# EAGLE design pcb v2 (EAGLE 7.5.0)
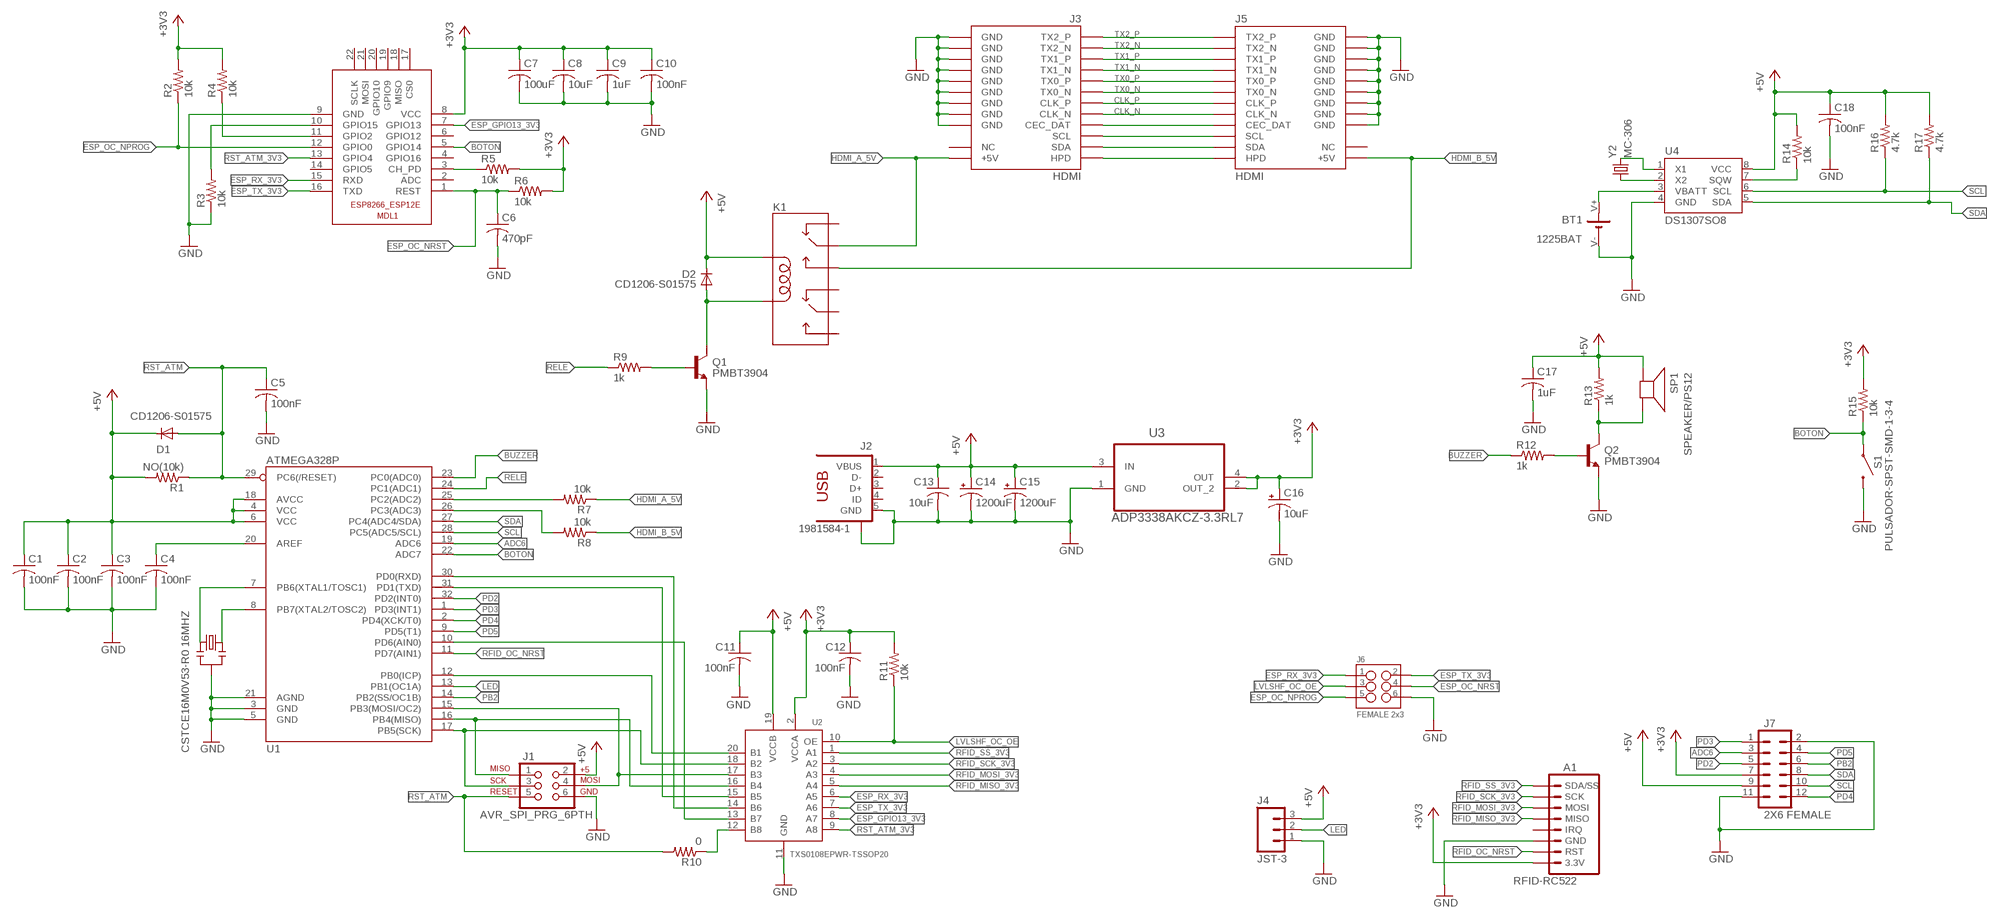
[diagram p0: schematic, sheet 1]

## Parts
A1  RFID-RC522  [RFID-RC522]
BT1  1225BAT  [BHSD-1225-SM]
C1  100nF  C-USC0603  [C0603]
C2  100nF  C-USC0603  [C0603]
C3  100nF  C-USC0603  [C0603]
C4  100nF  C-USC0603  [C0603]
C5  100nF  C-USC0603  [C0603]
C6  470pF  C-USC0603  [C0603]
C7  100uF  C-USC1206  [C1206]
C8  10uF  C-USC0805  [C0805]
C9  1uF  C-USC0805  [C0805]
C10  100nF  C-USC0603  [C0603]
C11  100nF  C-USC0603  [C0603]
C12  100nF  C-USC0603  [C0603]
C13  10uF  C-USC0805  [C0805]
C14  1200uF  CPOL-USUD-10X10  [UD-10X10_NICHICON]
C15  1200uF  CPOL-USUD-10X10  [UD-10X10_NICHICON]
C16  10uF  CPOL-USUD-5X5,8  [UD-5X5,8_NICHICON]
C17  1uF  C-USC0805  [C0805]
C18  100nF  C-USC0603  [C0603]
D1  CD1206-S01575  DIODE-MINIMELF  [MINIMELF]
D2  CD1206-S01575  DIODE-MINIMELF  [MINIMELF]
J1  AVR_SPI_PRG_6PTH  [2X3]
J2  1981584-1  [1981584-1]
J3  HDMI  [0471511071]
J4  JST-3  [B3B-PH-SM4-TB]
J5  HDMI  [0471511071]
J6  FEMALE 2x3  M03X2FEMALE  [2X3]
J7  2X6 FEMALE  M06X2PTH_FEMALE  [2X6]
K1  RELAY_EE2  [RELAY-EE2]
MDL1  ESP8266-12EESP8266-ESP12E  [ESP8266-ESP12E]
Q1  PMBT3904  [SOT-23-3]
Q2  PMBT3904  [SOT-23-3]
R1  NO(10k)  R-US_R0805  [R0805]
R2  10k  R-US_R0603  [R0603]
R3  10k  R-US_R0603  [R0603]
R4  10k  R-US_R0603  [R0603]
R5  10k  R-US_R0603  [R0603]
R6  10k  R-US_R0603  [R0603]
R7  10k  R-US_R0603  [R0603]
R8  10k  R-US_R0603  [R0603]
R9  1k  R-US_R0805  [R0805]
R10  0  R-US_R0805  [R0805]
R11  10k  R-US_R0603  [R0603]
R12  1k  R-US_R0805  [R0805]
R13  1k  R-US_R0805  [R0805]
R14  10k  R-US_R0603  [R0603]
R15  10k  R-US_R0603  [R0603]
R16  4.7k  R-US_R0603  [R0603]
R17  4.7k  R-US_R0603  [R0603]
S1  PULSADOR-SPST-SMD-1-3-4  [PTS645SM43SMTR92]
SP1  SPEAKER/PS12  [PS12]
U1  ATMEGA328P  ATMEGA328_SMT  [TQFP32-08]
U2  TXS0108EPWR-TSSOP20  LOGIC-TXS0108EPWR(TSSOP20)  [TSSOP20-0.65-6.5X4.4MM]
U3  ADP3338AKCZ-3.3RL7  [SOT230P700X180-4N]
U4  DS1307SO8  [SO08]
Y1  CSTCE16M0V53-R0 16MHZ  RESONATORMU  [RESONATOR]
Y2  MC-306  [MC-306]

## Nets
+3V3: A1.3.3V C7.1 C8.1 C9.1 C10.1 C12.1 C16.+ J7.7 MDL1.8(VCC) R2.2 R4.2 R5.2 R6.2 R11.2 R15.2 U2.2(VCCA) U3.2(OUT_2) U3.4(OUT)
+5V: C1.1 C2.1 C3.1 C11.1 C13.1 C14.+ C15.+ C17.1 C18.1 D1.C D2.C J1.2 J2.1(VBUS) J4.3 J7.9 K1.1(COIL+) R1.2 R13.2 R14.2 R16.2 R17.2 SP1.P$1(+) U1.4(VCC) U1.6(VCC) U1.18(AVCC) U2.19(VCCB) U3.3(IN) U4.8(VCC)
ADC6: J7.3 U1.19(ADC6)
BOTON: MDL1.5(GPIO14) R15.1 S1.P$1 U1.22(ADC7)
BUZZER: R12.1 U1.23(PC0(ADC0))
CLK_N [hdmi]: J3.P$12(CLK_N) J5.P$12(CLK_N)
CLK_P [hdmi]: J3.P$10(CLK_P) J5.P$10(CLK_P)
ESP_GPIO13_3V3: MDL1.7(GPIO13) U2.8(A7)
ESP_OC_NPROG: J6.5 MDL1.12(GPIO0) R2.1
ESP_OC_NRST: C6.1 J6.4 MDL1.1(REST) R6.1
ESP_RX_3V3: J6.1 MDL1.15(RXD) U2.6(A5)
ESP_TX_3V3: J6.2 MDL1.16(TXD) U2.7(A6)
GND [gnd]: A1.GND BT1.V- C1.2 C2.2 C3.2 C4.2 C5.2 C6.2 C7.2 C8.2 C9.2 C10.2 C11.2 C12.2 C13.2 C14.- C15.- C16.- C17.2 C18.2 J1.6 J2.5(GND) J2.S1 J2.S2 J2.S3 J2.S4 J3.P$2(GND) J3.P$5(GND) J3.P$8(GND) J3.P$11(GND) J3.P$17(GND) J3.P$20(GND) J3.P$21(GND) J3.P$22(GND) J3.P$23(GND) J4.1 J5.P$2(GND) J5.P$5(GND) J5.P$8(GND) J5.P$11(GND) J5.P$17(GND) J5.P$20(GND) J5.P$21(GND) J5.P$22(GND) J5.P$23(GND) J6.6 J7.2 J7.11 MDL1.9(GND) Q1.2(E) Q2.2(E) R3.1 S1.P$3 S1.P$4 U1.3(GND) U1.5(GND) U1.21(AGND) U2.11(GND) U3.1(GND) U4.4(GND) Y1.2
HDMI_A_5V: J3.P$18(+5V) K1.4(MAIN1) R7.1
HDMI_B_5V: J5.P$18(+5V) K1.5(OFF1) R8.1
LED: J4.2 U1.13(PB1(OC1A))
LVLSHF_OC_OE: J6.3 R11.1 U2.10(OE)
N$1: Q2.1(B) R12.2
N$2: U4.1(X1) Y2.4
N$3: U4.2(X2) Y2.1
N$4: U1.8(PB7(XTAL2/TOSC2)) Y1.3
N$5: Q2.3(C) R13.1 SP1.P$2(-)
N$6: R14.1 U4.7(SQW)
N$7: R10.1 U2.12(B8)
N$8: U1.12(PB0(ICP)) U2.20(B1)
N$9: BT1.V+ U4.3(VBATT)
N$10: MDL1.3(CH_PD) R5.1
N$11: U1.7(PB6(XTAL1/TOSC1)) Y1.1
N$13: MDL1.11(GPIO2) R4.1
N$14: C4.1 U1.20(AREF)
N$15: D2.A K1.12(COIL-) Q1.3(C)
N$16: MDL1.10(GPIO15) R3.2
N$17: J1.3 U1.17(PB5(SCK)) U2.18(B2)
N$18: J1.1 U1.16(PB4(MISO)) U2.16(B4)
N$19: J1.4 U1.15(PB3(MOSI/OC2)) U2.17(B3)
N$20: Q1.1(B) R9.2
N$21: U1.30(PD0(RXD)) U2.14(B6)
N$22: U1.31(PD1(TXD)) U2.15(B5)
N$30: J3.P$13(CEC_DAT) J5.P$13(CEC_DAT)
N$31: J3.P$15(SCL) J5.P$15(SCL)
N$32: J3.P$16(SDA) J5.P$16(SDA)
N$33: J3.P$19(HPD) J5.P$19(HPD)
N$34: R7.2 U1.25(PC2(ADC2))
N$37: R8.2 U1.26(PC3(ADC3))
N$41: U1.10(PD6(AIN0)) U2.13(B7)
PB2: J7.6 U1.14(PB2(SS/OC1B))
PD2: J7.5 U1.32(PD2(INT0))
PD3: J7.1 U1.1(PD3(INT1))
PD4: J7.12 U1.2(PD4(XCK/T0))
PD5: J7.4 U1.9(PD5(T1))
RELE: R9.1 U1.24(PC1(ADC1))
RFID_MISO_3V3: A1.MISO U2.5(A4)
RFID_MOSI_3V3: A1.MOSI U2.4(A3)
RFID_OC_NRST: A1.RST U1.11(PD7(AIN1))
RFID_SCK_3V3: A1.SCK U2.3(A2)
RFID_SS_3V3: A1.SDA(SDA/SS) U2.1(A1)
RST_ATM: C5.1 D1.A J1.5 R1.1 R10.2 U1.29(PC6(/RESET))
RST_ATM_3V3: MDL1.13(GPIO4) U2.9(A8)
SCL: J7.10 R16.1 U1.28(PC5(ADC5/SCL)) U4.6(SCL)
SDA: J7.8 R17.1 U1.27(PC4(ADC4/SDA)) U4.5(SDA)
TX0_N [hdmi]: J3.P$9(TX0_N) J5.P$9(TX0_N)
TX0_P [hdmi]: J3.P$7(TX0_P) J5.P$7(TX0_P)
TX1_N [hdmi]: J3.P$6(TX1_N) J5.P$6(TX1_N)
TX1_P [hdmi]: J3.P$4(TX1_P) J5.P$4(TX1_P)
TX2_N [hdmi]: J3.P$3(TX2_N) J5.P$3(TX2_N)
TX2_P [hdmi]: J3.P$1(TX2_P) J5.P$1(TX2_P)
Unconnected: A1.IRQ J2.2(D-) J2.3(D+) J2.4(ID) J3.P$14(NC) J5.P$14(NC) K1.3(ON1) K1.8(OFF2) K1.9(MAIN2) K1.10(ON2) MDL1.2(ADC) MDL1.4(GPIO16) MDL1.6(GPIO12) MDL1.14(GPIO5) MDL1.17(CS0) MDL1.18(MISO) MDL1.19(GPIO9) MDL1.20(GPIO10) MDL1.21(MOSI) MDL1.22(SCLK)

## Library data of the parts
A1 = partes v2:RFID-RC522
BT1 = partes v2:1225BAT
C1-C13 C17 C18 = rcl:C-US: CAPACITOR, American symbol
C14-C16 = rcl:CPOL-US: POLARIZED CAPACITOR, American symbol
D1 D2 = diode:DIODE-: DIODE
J1 = SparkFun-Connectors:AVR_SPI_PRG_6: AVR ISP 6 Pin This is the reduced ISP connector for AVR programming. Common on Arduino. This footprint will take up less PCB space and can be used with a 10-pin to 6-pin adapter such as SKU: BOB-08508 **Special note about "TEST_POINT" package. The stop mask is on the top side, so if you want your programming test points to be on the bottom of your board, make sure to place this package on the bottom side of the board. This also ensure that the orientation to program from the bottom side will be correct.
J2 = con-usb:1981584-1: Receptacle, micro-USB, type A/B Tyco Electronics
J3 J5 = partes v2:HDMI
J4 = partes v2:JST-3
J6 = SparkFun-Connectors:M03X2: 2x3 .1" header. Shrouded, with keying- CONN-10681 SMT- CONN-11415 Pogo pins- HW-11044; PROD_ID: CONN-11566
J7 = SparkFun-Connectors:M06X2; PROD_ID: CONN-12423
K1 = pimoroni-mechanical:RELAY_EE2
MDL1 = ESP8266-ESP12E:ESP8266-12E: ESP8266-12E with additional I/O and GPIO04/05 corrected The author cannot warrant that this library is free from error or will meet your specific requirements. Created by PuceBaboon.com. Komagane, Nagano, JAPAN
Q1 Q2 = diego:PMBT3904: PMBT3904 NPN switching transistor in a SOT23 plastic package. PNP complement: PMBT3906.
R1-R17 = rcl:R-US_: RESISTOR, American symbol
S1 = partes v2:PULSADOR-SPST
SP1 = adafruit:SPEAKER: SPEAKER Source: Buerklin Added PS12 (for part # PS1240 piezo) http://www.ladyada.net/library/pcb/eaglelibrary.html
U1 = SparkFun-DigitalIC:ATMEGA328_SMT: 32-Pin Atmega328 part Commonly used on Arduino compatible boards Available in QFP and QFN packages TQFP is IC-09069 QFN is non-stock; PROD_ID: IC-09069
U2 = Seeed-IC-2016:LOGIC-TXS0108EPWR(TSSOP20): 310050026; MPN: TXS0108EPWR
U3 = ADI-Phase-2:ADP3338AKCZ-3.3RL7: Low Dropout Regulator; MPN: ADP3338AKCZ-3.3RL7; OC_FARNELL: 1319313; OC_NEWARK: 19M8720; PACKAGE: SOT-223-3; SUPPLIER: Analog Devices
U4 = SparkFun-FreqCtrl:DS1307: I2C real-time clock with battery backup.
Y1 = SmartPrj:RESONATOR
Y2 = crystal:MC-306: kHz RANGE CRYSTAL UNIT SMD Source: MC-306_405_406_E07X.PDF Homepage <http://www.epsontoyocom.co.jp>; MPN: MC-306 60.0KHZ 100PPM ,12.5PF; OC_FARNELL: 1278040; OC_NEWARK: 31M5576

## Net classes
0 default: width 0.254 mm
1 hdmi: width 0.3 mm, clearance 0.178 mm
2 gnd: width 0.254 mm

## Board
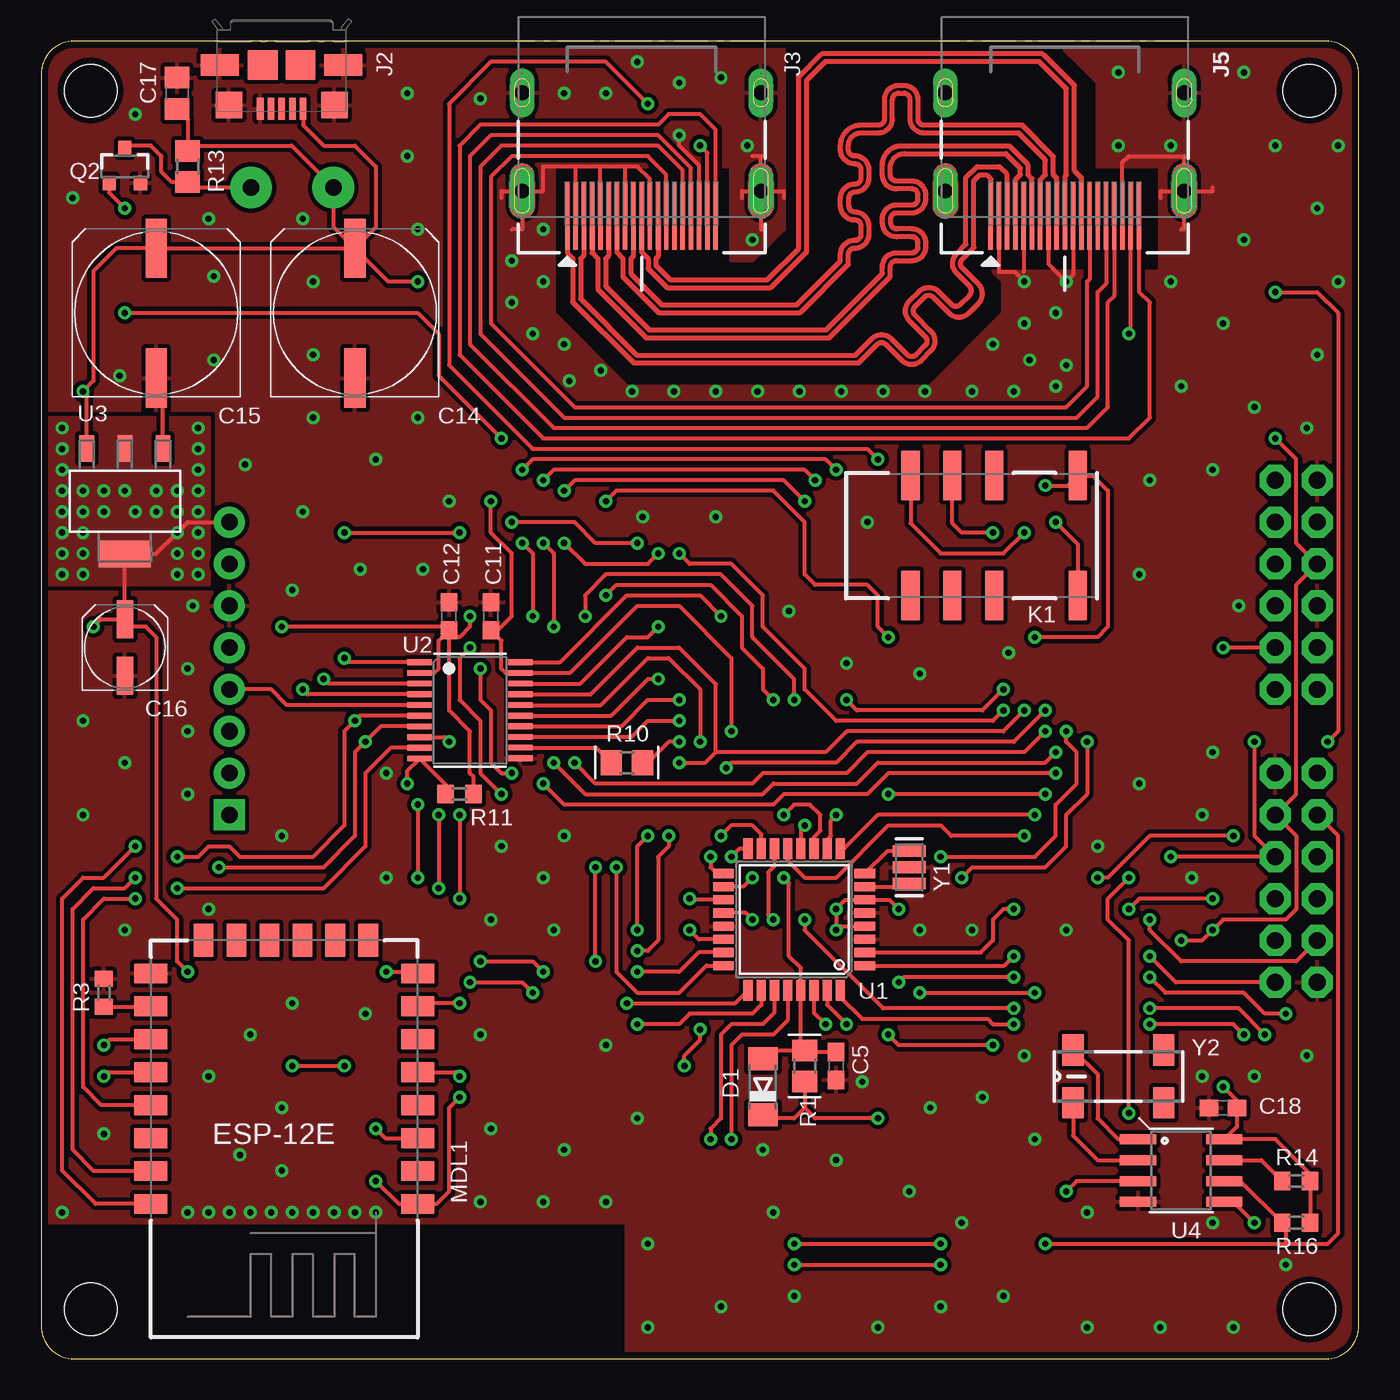
[diagram p1: board, top side]
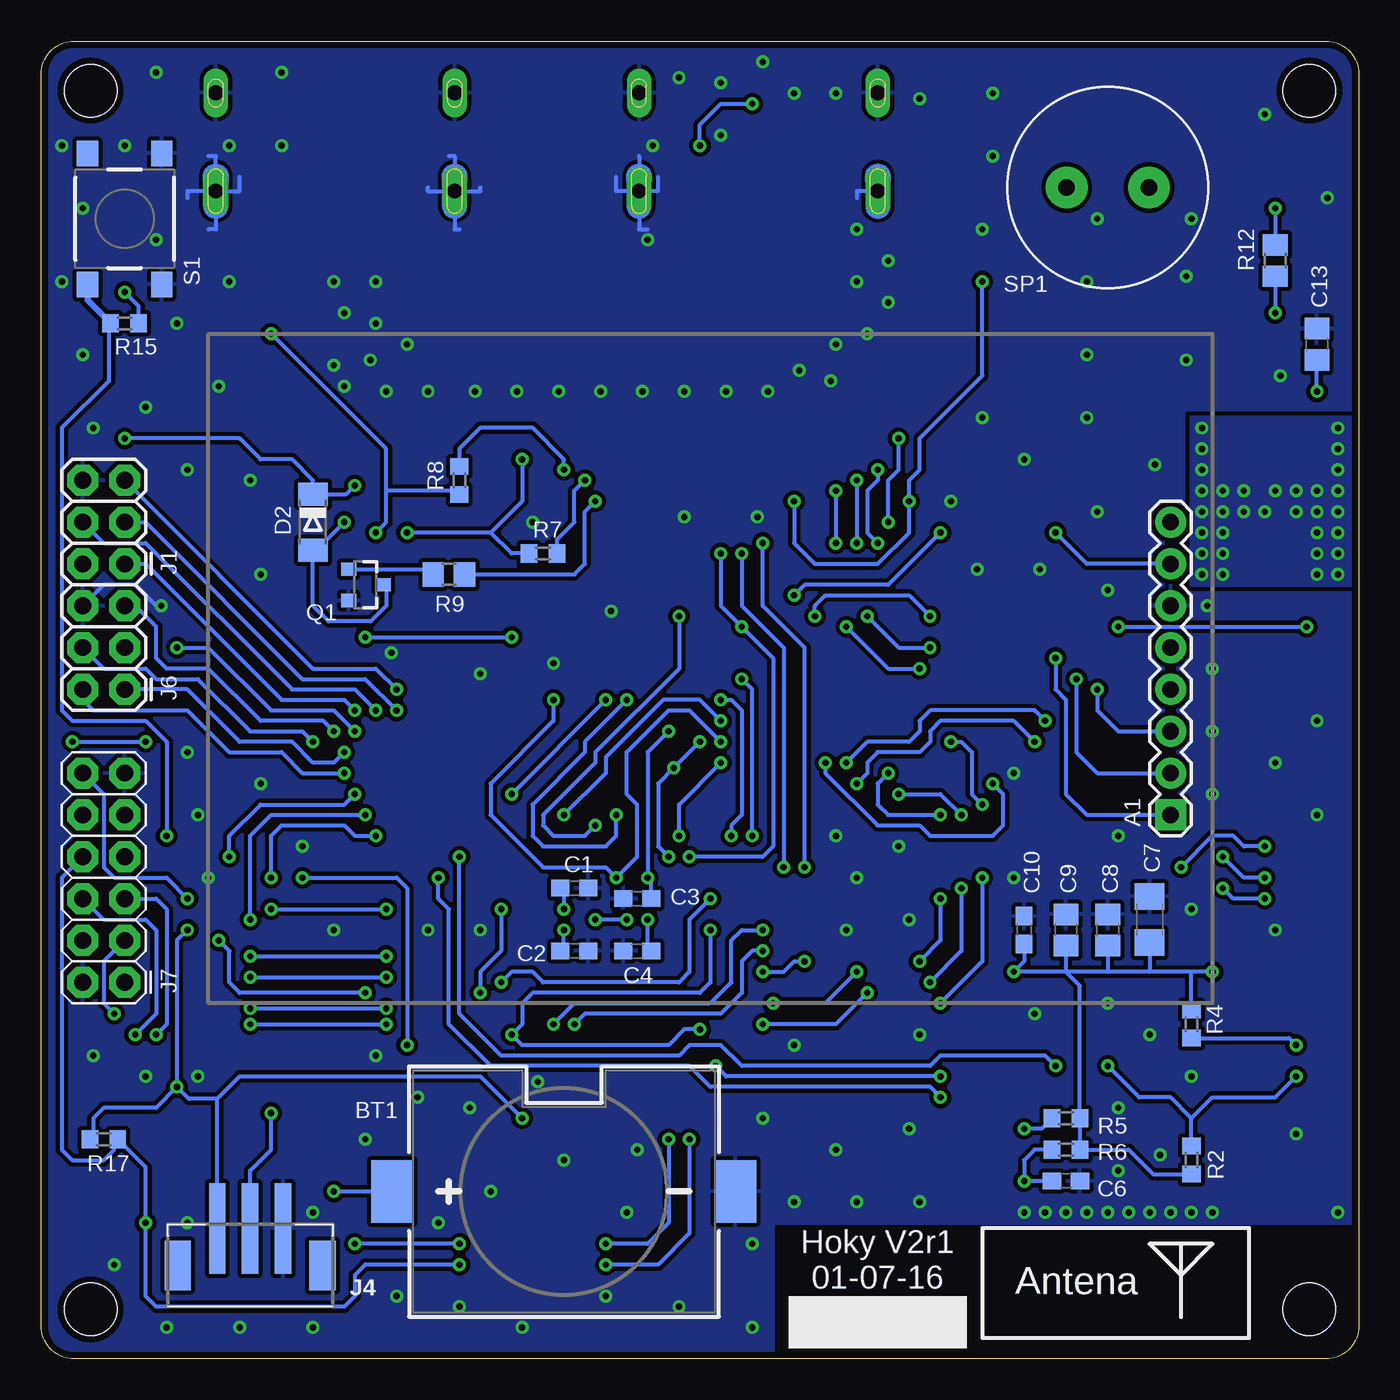
[diagram p2: board, bottom side, seen from below]

Size 80 x 80 mm. Coordinates in mm from the lower left corner, seen from the top.
Outline: 0,2 arc90 2,0 78,0 arc90 80,2 80,78 arc90 78,80 2,80 arc90 0,78 0,2
Copper layers (1*16): Top 0.035mm / dielectric 1.5mm / Bottom 0.035mm
Design rules "SeeedStudio_2layer_DRU_no_angle_20140221 *": minimum track width 6mil, minimum drill 12mil, track to track 6mil, track to pad 6mil, pad to pad 6mil, via to via 6mil, smd to smd 0mil, copper to edge 16mil, drill to drill 10mil, minimum pad ring 10mil, minimum via ring 6mil, stop-mask expansion 2mil, vias tented up to drill 100mil, thermal gap 10mil
Holes 3.17 mm at 3,77 77,77 3,3 77,3

### Footprints (pad centres in the part's own frame; a part is rotated, then mirrored left to right if it is on the bottom)
RFID-RC522 = drill 1.016 pad 1.88: 3.3V 8.89,0; GND 3.81,0; IRQ 1.27,0; MISO -1.27,0; MOSI -3.81,0; RST 6.35,0; SCK -6.35,0 | drill 1.016 pad 1.88 square: SDA -8.89,0
BHSD-1225-SM = smd 2.54 x 3.81: V+ -10.415,0; V- 10.415,0
C0603 = smd 1.1 x 1: 1 -0.85,0; 2 0.85,0
C1206 = smd 1.6 x 1.8: 1 -1.4,0; 2 1.4,0
C0805 = smd 1.3 x 1.5: 1 -0.95,0; 2 0.95,0
UD-10X10_NICHICON = smd 3.6 x 1.3: + 3.925,0; - -3.95,0
UD-5X5,8_NICHICON = smd 2.3 x 1: + 1.725,0; - -1.7,0
MINIMELF = smd 1.4 x 1.8: A 1.7,0; C -1.7,0
2X3 = drill 1.016 pad 1.88 octagon: 1 0,0; 2 0,2.54; 3 2.54,0; 4 2.54,2.54; 5 5.08,0; 6 5.08,2.54
1981584-1 = smd 0.4 x 1.35: 1 -1.3,4.1; 2 -0.65,4.1; 3 0,4.1; 4 0.65,4.1; 5 1.3,4.1 | smd 1.8 x 1.8: M1 -1.15,1.45; M2 1.15,1.45 | smd 2.3 x 1.3: S1 -3.75,1.45; S2 3.75,1.45 | smd 1.6 x 1.6: S3 -3.2,3.885; S4 3.2,3.885
0471511071 = smd 0.3 x 4.1: P$1 4.5,3.75; P$2 4,3.75; P$3 3.5,3.75; P$4 3,3.75; P$5 2.5,3.75; P$6 2,3.75; P$7 1.5,3.75; P$8 1,3.75; P$9 0.5,3.75; P$10 0,3.75; P$11 -0.5,3.75; P$12 -1,3.75; P$13 -1.5,3.75; P$14 -2,3.75; P$15 -2.5,3.75; P$16 -3,3.75; P$17 -3.5,3.75; P$18 -4,3.75; P$19 -4.5,3.75 | drill 0.9 pad 1.5 long: P$20 -7.25,2.24; P$21 7.25,2.24; P$22 -7.25,-3.72; P$23 7.25,-3.72
B3B-PH-SM4-TB = smd 1 x 5.5: 1 -2,-0.3; 2 0,-0.3; 3 2,-0.3 | smd 1.6 x 3: NC1 -4.4,1.95; NC2 4.4,1.95
2X6 = drill 1.016 pad 1.88 octagon: 1 0,0; 2 0,2.54; 3 2.54,0; 4 2.54,2.54; 5 5.08,0; 6 5.08,2.54; 7 7.62,0; 8 7.62,2.54; 9 10.16,0; 10 10.16,2.54; 11 12.7,0; 12 12.7,2.54
RELAY-EE2 = smd 1.11 x 3: 1 -6.45,-3.645; 3 -1.37,-3.645; 4 1.17,-3.645; 5 3.71,-3.645; 8 3.71,3.645; 9 1.17,3.645; 10 -1.37,3.645; 12 -6.45,3.645
ESP8266-ESP12E = smd 2 x 1.2: 1 0,16; 2 0,14; 3 0,12; 4 0,10; 5 0,8; 6 0,6; 7 0,4; 8 0,2; 9 16.2,2; 10 16.2,4; 11 16.2,6; 12 16.2,8; 13 16.2,10; 14 16.2,12; 15 16.2,14; 16 16.2,16 | smd 1.2 x 2: 17 11,0; 18 3,0; 19 5,0; 20 13,0; 21 7,0; 22 9,0
SOT-23-3 = smd 0.8 x 0.9: 1 -0.95,-1; 2 0.95,-1; 3 0,1.1
R0805 = smd 1.3 x 1.5: 1 -0.95,0; 2 0.95,0
R0603 = smd 1 x 1.1: 1 -0.85,0; 2 0.85,0
PTS645SM43SMTR92 = smd 1.55 x 1.3: P$1 -3.975,2.25; P$2 3.975,2.25; P$3 -3.975,-2.25; P$4 3.975,-2.25
PS12 = drill 1 pad 2.54: P$1 -2.5,0; P$2 2.5,0
TQFP32-08 = smd 1.27 x 0.559: 1 -4.293,2.8; 2 -4.293,2; 3 -4.293,1.2; 4 -4.293,0.4; 5 -4.293,-0.4; 6 -4.293,-1.2; 7 -4.293,-2; 8 -4.293,-2.8; 17 4.293,-2.8; 18 4.293,-2; 19 4.293,-1.2; 20 4.293,-0.4; 21 4.293,0.4; 22 4.293,1.2; 23 4.293,2; 24 4.293,2.8 | smd 0.559 x 1.27: 9 -2.8,-4.293; 10 -2,-4.293; 11 -1.2,-4.293; 12 -0.4,-4.293; 13 0.4,-4.293; 14 1.2,-4.293; 15 2,-4.293; 16 2.8,-4.293; 25 2.8,4.293; 26 2,4.293; 27 1.2,4.293; 28 0.4,4.293; 29 -0.4,4.293; 30 -1.2,4.293; 31 -2,4.293; 32 -2.8,4.293
TSSOP20-0.65-6.5X4.4MM = smd 0.35 x 1.5: 1 -2.925,-3.065; 2 -2.275,-3.065; 3 -1.625,-3.065; 4 -0.975,-3.065; 5 -0.325,-3.065; 6 0.325,-3.065; 7 0.975,-3.065; 8 1.625,-3.065; 9 2.275,-3.065; 10 2.925,-3.065; 11 2.91,3.065; 12 2.26,3.065; 13 1.61,3.065; 14 0.96,3.065; 15 0.325,3.065; 16 -0.325,3.065; 17 -0.975,3.065; 18 -1.625,3.065; 19 -2.275,3.065; 20 -2.925,3.065
SOT230P700X180-4N = smd 1.626 x 0.889: 1 -3.2,2.311; 2 -3.2,0; 3 -3.2,-2.311 | smd 1.626 x 3.175: 4 3.2,0
SO08 = smd 0.61 x 2.21: 1 -1.905,-2.616; 2 -0.635,-2.616; 3 0.635,-2.616; 4 1.905,-2.616; 5 1.905,2.616; 6 0.635,2.616; 7 -0.635,2.616; 8 -1.905,2.616
RESONATOR = smd 0.7 x 2: 1 -1,0; 2 0,0; 3 1,0
MC-306 = smd 1.3 x 1.9: 1 -2.75,-1.6; 2 2.75,-1.6; 3 2.75,1.6; 4 -2.75,1.6

### Placement (x,y rotation side)
A1  11.43,41.91 90 bottom
BT1  48.26,10.16 0 bottom
C1  47.62,28.57 0 bottom
C2  47.62,24.77 0 bottom
C3  43.81,27.94 180 bottom
C4  43.81,24.77 180 bottom
C5  48.26,17.78 270 top
C6  17.78,10.79 0 bottom
C7  12.7,26.67 90 bottom
C8  15.24,26.04 90 bottom
C9  17.78,26.04 90 bottom
C10  20.32,26.04 90 bottom
C11  27.3,45.09 90 top
C12  24.77,45.09 90 top
C13  2.54,61.59 90 bottom
C14  19.05,63.5 90 top
C15  6.99,63.5 90 top
C16  5.08,43.18 90 top
C17  8.26,76.83 90 top
C18  71.75,15.24 180 top
D1  43.81,16.51 90 top
D2  63.5,50.8 270 bottom
J1  74.93,48.26 90 bottom
J2  14.6,80 180 top
J3  36.45,73.14 180 top
J4  67.31,7.62 180 bottom
J5  62.15,73.14 180 top
J6  74.93,40.64 90 bottom
J7  74.93,22.86 90 bottom
K1  56.49,49.98 180 top
MDL1  22.86,25.4 180 top
Q1  60.33,46.99 270 bottom
Q2  5.08,72.39 0 top
R1  46.35,17.78 270 top
R2  10.16,12.06 270 bottom
R3  3.81,22.23 270 top
R4  10.16,20.32 90 bottom
R5  17.78,14.61 0 bottom
R6  17.78,12.7 0 bottom
R7  49.53,48.9 0 bottom
R8  54.61,53.34 90 bottom
R9  55.24,47.62 180 bottom
R10  35.56,36.2 0 top
R11  25.4,34.29 0 top
R12  5.08,66.67 90 bottom
R13  8.89,72.39 90 top
R14  76.2,10.79 0 top
R15  74.93,62.87 0 bottom
R16  76.2,8.26 0 top
R17  76.2,13.34 180 bottom
S1  74.93,69.22 90 bottom
SP1  15.24,71.12 0 bottom
U1  45.72,26.67 180 top
U2  26.04,39.37 270 top
U3  5.08,52.07 270 top
U4  69.22,11.43 270 top
Y1  52.7,29.84 90 top
Y2  65.41,17.14 0 top

### Tracks (layer width: path | path; a pad name or v marks a point on that pad's centre or on a via)
+3V3  (via drill 0.38 pad 0.79)
  Top 0.254: A1.3.3V 8.89,50.8 v8.26,50.16 6.96,48.87 U3.4 C16.+ | C16.+ 5.54,44.45 6.35,44.45 6.99,43.81 6.99,27.94 8.26,26.67 8.26,24.13 v8.89,23.5 | v20.95,23.5 22.77,23.5 MDL1.8 | U2.2 23.86,41.65 24.13,41.91 24.13,43.6 C12.1 | R11.2 26.25,35.34 26.04,35.56 26.04,38.1 24.77,39.37 C12.1 | C12.1 24.55,44.45 v14.61,44.45 | v3.17,44.45 3.63,44.91 C16.+ | v68.58,30.48 J7.7 73.66,31.75 v73.66,37.47 | v60.96,34.29 v51.44,34.29 | v45.72,40.01 45.72,41.27 43.18,43.81 43.18,45.72 41.27,47.62 34.29,47.62 33.02,46.35 v33.02,45.09 | v26.04,45.09 26.04,44.45 25.4,43.81 25.18,43.81 C12.1 | v74.93,64.77 77.47,64.77 78.74,63.5 78.74,38.1 v78.11,37.47
  Bottom 0.254: v8.89,23.5 10.16,23.5 | 10.16,23.5 12.7,23.5 | 12.7,23.5 15.24,23.5 | 15.24,23.5 17.78,23.5 | 17.78,23.5 v20.95,23.5 20.32,24.13 C10.1 | R4.2 10.16,23.5 | C7.1 12.7,23.5 | C8.1 15.24,23.5 | C9.1 17.78,23.5 | R2.2 12.48,11.21 13.97,12.7 R6.2 R5.2 16.93,22.64 17.78,23.5 | v14.61,44.45 v3.17,44.45 | v68.58,30.48 68.58,31.75 66.67,33.66 61.59,33.66 v60.96,34.29 | v51.44,34.29 v45.72,40.01 | v33.02,45.09 33.02,45.72 32.38,46.35 27.3,46.35 v26.04,45.09 | R15.2 74.08,63.92 v74.93,64.77 | v78.11,37.47 v73.66,37.47
  other vias: 1.27,52.7 2.54,52.7 3.81,52.7 5.08,52.7 6.99,52.7 8.26,52.7 1.27,51.44 2.54,51.44 3.81,51.44 5.71,51.44 6.99,51.44 8.26,51.44 1.27,50.16 1.27,48.9 8.26,48.9 2.54,47.62 8.26,47.62 1.27,56.52 9.53,56.52 9.53,47.62 1.27,47.62 9.53,55.24 9.53,53.98 9.53,52.7 9.53,51.44 9.53,50.16 9.53,48.9 1.27,55.24 1.27,53.98 2.54,48.9 2.54,50.16
  pour Top (isolate 0.254, no thermals): -0.64,57.15 10.16,57.15 10.16,46.99 -1.27,46.99
  pour Bottom (isolate 0.254, no thermals): -0.64,57.15 10.16,57.15 10.16,46.99 -1.91,46.99
+5V  (via drill 0.38 pad 0.79)
  Top 0.254: C14.+ C15.+ 4.56,67.42 3.17,66.04 3.17,59.37 v2.54,58.74 2.77,58.51 U3.3 | C14.+ 17.74,68.73 SP1.P$1 15.2,73.66 9.21,73.66 R13.2 8.89,75.25 C17.1 | v60.96,53.02 62.34,53.02 K1.1 63.85,53.62 64.77,52.7 64.77,44.45 64.14,43.81 v60.33,43.81 | R16.2 R14.2 77.05,11.21 74.93,13.34 U4.8 | 71.75,13.41 U4.8 | v43.18,29.21 42.64,28.67 U1.18 | U1.4 48.49,26.27 v48.26,26.04 v48.26,27.3 48.83,27.87 U1.6 51.51,27.87 v52.07,27.3 | R1.2 46.35,15.24 | 46.35,15.24 45.72,14.61 44.02,14.61 D1.C | v50.8,14.61 46.99,14.61 46.35,15.24 | v41.91,38.1 41.91,42.55 38.73,45.72 36.2,45.72 32.12,41.65 U2.19 28.2,41.65 27.94,41.91 27.94,43.6 C11.1 27.73,44.23 28.57,45.09 28.57,48.9 27.3,50.16 v27.3,52.07 | v22.86,65.41 21.07,65.41 C14.+ | v51.44,43.81 50.8,44.45 50.8,46.35 50.16,46.99 46.99,46.99 46.35,47.62 46.35,50.8 44.45,52.7 34.92,52.7 v34.29,52.07 | v53.34,22.23 v60.33,22.23 | v69.22,25.4 70.48,25.4 v71.12,26.04 71.75,26.67 75.56,26.67 76.2,27.3 76.2,31.75 J7.9 76.2,34.29 76.2,46.99 J1.2 76.2,49.53 76.2,54.61 v74.93,55.88 | v71.75,16.51 72.61,15.66 C18.1 72.61,14.11 U4.8 | J2.1 15.9,74.91 17.14,73.66 19.05,73.66 20.32,72.39 20.32,68.69 C14.+
  Bottom 0.254: v60.96,53.02 61.48,52.5 D2.C 63.5,53.34 64.77,54.61 66.67,54.61 67.94,55.88 v74.93,55.88 | J4.3 69.31,15.78 | v71.75,16.51 73.03,15.24 76.2,15.24 76.83,14.61 76.83,13.55 R17.2 | C3.1 42.97,29 v43.18,29.21 43.18,36.83 v41.91,38.1 | C2.1 48.26,24.98 v48.26,26.04 | C1.1 48.26,28.36 v48.26,27.3 | 69.31,15.78 67.94,17.14 53.34,17.14 v50.8,14.61 | v71.12,26.04 71.75,25.4 v71.75,16.51 | v22.86,65.41 22.86,59.69 26.67,55.88 26.67,53.98 27.3,53.34 v27.3,52.07 27.3,50.16 29.21,48.26 33.02,48.26 34.29,49.53 v34.29,52.07 | v60.33,43.81 v51.44,43.81 | v52.07,27.3 52.07,24.77 53.34,23.5 v53.34,22.23 | v60.33,22.23 67.94,22.23 68.58,22.86 68.58,24.77 v69.22,25.4 | 69.31,15.78 71.03,15.78 v71.75,16.51 | v2.54,58.74 C13.1
ADC6  (via drill 0.38 pad 0.79)
  Top 0.254: U1.19 39.44,27.87 v39.37,27.94 | v75.56,20.95 74.3,20.95 73.03,22.23 68.26,22.23 v67.31,23.18 | v59.05,23.18 52.39,23.18 v52.07,22.86
  Bottom 0.254: v39.37,27.94 40.64,26.67 40.64,23.5 41.27,22.86 49.53,22.86 50.16,23.5 51.44,23.5 v52.07,22.86 | J7.3 76.2,24.13 76.2,21.59 v75.56,20.95 | v67.31,23.18 v59.05,23.18
BOTON  (via drill 0.38 pad 0.79)
  Top 0.254: v72.39,31.75 67.31,31.75 64.77,29.21 v64.14,29.21 | v57.78,19.05 52.07,19.05 v51.44,19.68 | MDL1.5 25.14,17.4 v25.4,17.14 | v39.05,17.78 39.05,18.41 40.01,19.37 v40.01,20 | U1.22 39.94,25.47 v39.37,26.04
  Bottom 0.254: v72.39,31.75 72.39,37.47 73.66,38.73 78.11,38.73 78.74,39.37 78.74,56.52 75.88,59.38 75.88,62.77 R15.1 | v64.14,29.21 58.42,29.21 57.78,28.57 v57.78,19.05 | v25.4,17.14 38.42,17.14 v39.05,17.78 | v40.01,20 40.96,20 41.91,19.05 50.8,19.05 v51.44,19.68 50.8,20.32 50.8,21.59 50.16,22.23 40.01,22.23 39.37,22.86 v39.37,26.04
  Bottom 0.406: R15.1 77.18,64.27 S1.P$1
BUZZER  (via drill 0.38 pad 0.79)
  Top 0.254: v5.08,63.5 22.86,63.5 24.13,62.23 24.13,59.69 v27.94,55.88 | v33.66,24.13 v33.66,29.84 | v36.2,49.53 33.66,49.53 32.38,50.8 v28.57,50.8 | U1.23 39.91,24.67 38.73,23.5 v36.2,23.5
  Bottom 0.254: R12.1 v5.08,63.5 | v36.2,23.5 34.92,23.5 34.29,24.13 v33.66,24.13 | v33.66,29.84 33.66,43.18 36.2,45.72 v36.2,49.53 | v28.57,50.8 28.57,53.34 27.94,53.98 v27.94,55.88
CLK_N
  Top 0.3: J5.P$12 63.15,71.71 62.72,72.14 62.72,77.31 60.8,79.23 47.4,79.23 45.99,77.82 45.99,67.41 44.1,65.52 38.2,65.52 37.32,66.39 37.32,66.8 37.45,66.93 J3.P$12
CLK_P
  Top 0.3: J5.P$10 62.15,71.79 62.24,71.88 62.24,77.12 60.61,78.75 47.6,78.75 46.47,77.62 46.47,67.21 44.3,65.04 38,65.04 36.84,66.19 36.84,66.8 36.45,67.2 J3.P$10
ESP_GPIO13_3V3  (via drill 0.38 pad 0.79)
  Top 0.254: U2.8 24.48,37.74 v24.77,37.47 | v25.4,21.59 23.05,21.59 MDL1.7 | v22.86,33.66 v22.86,29.21
  Bottom 0.254: v24.77,37.47 24.13,37.47 23.5,36.83 23.5,34.29 v22.86,33.66 | v25.4,21.59 22.86,24.13 v22.86,29.21
ESP_OC_NPROG  (via drill 0.38 pad 0.79)
  Top 0.254: v3.81,17.14 4.07,17.4 MDL1.12 | v15.24,17.78 v18.41,17.78 | v54.61,30.48 60.33,30.48 61.59,31.75 61.59,33.66 62.87,34.92 62.87,36.83 62.23,37.47 v62.23,38.1
  Bottom 0.254: R2.1 10.16,14.61 | 10.16,14.61 8.89,15.88 5.08,15.88 v3.81,17.14 | 10.16,14.61 11.43,15.88 13.34,15.88 v15.24,17.78 | v18.41,17.78 19.05,18.41 25.4,18.41 26.04,17.78 37.47,17.78 38.73,19.05 40.64,19.05 41.27,18.41 52.07,18.41 54.61,20.95 v54.61,30.48 | v62.23,38.1 62.87,38.73 66.67,38.73 69.85,41.91 72.39,41.91 73.03,42.55 73.03,44.45 74.3,45.72 J6.5
ESP_OC_NRST  (via drill 0.38 pad 0.79)
  Top 0.254: v20.32,10.79 21.71,9.4 MDL1.1 24,9.4 24.77,10.16 24.77,15.24 v25.4,15.88 | v55.88,29.21 56.52,29.84 60.96,29.84 62.23,31.11 62.23,33.02 63.5,34.29 v63.5,37.47
  Bottom 0.254: C6.1 v20.32,10.79 20.32,12.06 19.68,12.7 R6.1 | v25.4,15.88 26.04,16.51 39.37,16.51 40.64,17.78 52.7,17.78 55.24,20.32 55.24,27.3 55.88,27.94 v55.88,29.21 | J6.4 76.2,41.91 73.66,41.91 73.03,41.27 70.48,41.27 67.31,38.1 64.14,38.1 v63.5,37.47
ESP_RX_3V3  (via drill 0.38 pad 0.79)
  Top 0.254: MDL1.15 3.21,11.4 1.91,12.7 1.91,27.3 3.17,28.57 5.08,28.57 v5.71,29.21 | v8.26,30.48 9.53,30.48 10.16,31.11 11.43,31.11 12.06,30.48 16.51,30.48 18.41,32.38 18.41,38.1 v19.05,38.73 19.36,39.05 U2.6 | v61.59,36.83 60.96,36.2 50.8,36.2 49.53,34.92 44.45,34.92 43.81,34.29 33.02,34.29 v31.11,36.2
  Bottom 0.254: v5.71,29.21 6.99,29.21 v8.26,30.48 | v19.05,38.73 19.68,39.37 26.04,39.37 26.67,38.73 26.67,38.1 27.3,37.47 29.84,37.47 v31.11,36.2 | v61.59,36.83 62.23,36.2 63.5,36.2 64.77,37.47 67.94,37.47 71.12,40.64 J6.1
ESP_TX_3V3  (via drill 0.38 pad 0.79)
  Top 0.254: MDL1.16 3.3,9.4 1.27,11.43 1.27,27.94 2.54,29.21 3.81,29.21 v5.71,31.11 | v10.79,29.84 17.14,29.84 19.05,31.75 19.05,36.83 v19.68,37.47 20.61,38.4 U2.7 | v61.59,35.56 51.44,35.56 50.16,34.29 45.09,34.29 44.45,33.66 31.75,33.66 v30.48,34.92
  Bottom 0.254: v5.71,31.11 6.99,31.11 7.62,31.75 8.89,31.75 v10.79,29.84 | v19.68,37.47 20.95,38.73 25.4,38.73 26.04,38.1 26.04,37.47 26.67,36.83 29.21,36.83 29.84,36.2 29.84,35.56 v30.48,34.92 | J6.2 77.47,40.01 76.83,39.37 71.12,39.37 68.58,36.83 65.41,36.83 64.14,35.56 v61.59,35.56
GND  (via drill 0.38 pad 0.79)
  Top 0.254: J3.P$2 32.45,72.39 | 32.45,72.39 30.48,72.39 30.48,70.9 27.94,70.9 27.94,70.48 | J3.P$5 33.95,72.39 | 33.95,72.39 32.45,72.39 | J3.P$8 35.45,72.39 | 35.45,72.39 33.95,72.39 | J3.P$11 36.95,71.64 36.2,72.39 35.45,72.39 | J3.P$17 39.95,72.44 38.73,73.66 v38.73,74.3 | J3.P$20 43.7,68.58 43.81,68.58 | J3.P$21 29.2,68.58 28.57,68.58 | 69.22,68.58 69.4,68.58 69.4,73.03 66.04,73.03 65.65,72.64 J5.P$17 | 67.94,70.48 67.94,70.9 J5.P$20 71.12,70.9 71.12,71.12 | 42.55,70.48 42.55,70.9 J3.P$20 | J3.P$20 45.09,70.9 45.09,70.48 | J3.P$20 43.7,73.03 43.18,73.03 | J5.P$2 58.15,65.99 59.1,65.99 v59.69,65.41 | J5.P$11 62.65,65.83 v62.23,65.41 61.15,66.48 J5.P$8 | J5.P$5 59.65,66 | U3.1 7.39,59.14 C15.-
  Bottom 0.254: J3.P$21 30.48,70.9 30.48,70.48 | 42.55,71.75 42.55,70.9 45.09,70.9 45.09,71.75 | 43.7,73.03 43.7,68.58 43.18,68.58 | 56.52,71.12 56.52,70.9 J5.P$21 53.34,70.9 53.34,71.12 | 55.24,73.03 54.9,73.03 54.9,68.58 54.61,68.58 | J5.P$20 67.94,70.9 67.94,71.75 | J5.P$20 71.12,70.9 71.12,70.48 | J5.P$20 69.4,73.03 69.85,73.03 | J5.P$20 69.4,68.58 69.85,68.58 | v72.71,45.72 73.03,45.72 74.3,46.99 76.2,46.99 J6.6
  other vias: 30.48,68.58 35.88,58.74 8.89,8.89 10.16,8.89 11.43,8.89 12.7,8.89 13.97,8.89 15.24,8.89 16.51,8.89 17.78,8.89 19.05,8.89 20.32,8.89 14.61,15.24 12.06,12.38 14.61,11.43 36.51,51.12 40.96,51.12 38.42,58.74 40.96,58.74 19.37,47.94 43.5,58.74 23.18,47.94 69.85,29.21 9.21,45.72 45.4,45.4 46.04,58.74 48.58,58.74 51.12,58.74 53.66,58.74 60.01,60.64 58.74,42.86 61.59,63.5 66.67,34.92 59.69,62.87 57.78,61.59 62.23,60.33 61.59,59.05 53.34,41.59 59.05,58.74 15.24,46.67 56.52,58.74 48.9,42.23 33.97,60.01 12.38,54.29 22.86,57.15 24.77,52.07 29.84,62.23 31.75,61.59 28.57,66.67 30.48,65.41 28.57,64.14 16.51,57.15 32.07,59.37 31.75,76.83 43.18,67.94 16.51,65.41 10.48,60.64 10.48,65.72 42.86,73.66 26.67,76.52 41.27,77.79 3.81,13.65 22.23,76.83 20.32,54.61 15.88,51.44 1.91,70.48 38.73,77.47 36.2,78.74 16.51,60.96 4.76,59.69 10.16,69.22 22.86,68.58 15.88,69.22 22.23,73.03 2.54,38.73 31.75,31.75 2.54,33.02 5.08,36.2 8.89,41.91 8.89,38.1 8.89,34.29 34.29,76.83 65.41,78.11 65.41,73.66 20.95,35.56 68.58,73.66 73.03,78.11 74.93,73.66 78.74,65.41 68.58,65.41 73.03,67.94 77.47,69.85 77.47,60.96 30.48,29.21 14.61,31.75 71.75,62.87 10.16,27.3 73.66,57.78 78.74,73.66 69.22,59.05 27.94,31.11 20.95,29.21 76.83,56.52 71.12,53.98 67.31,53.34 66.67,47.62 71.12,36.83 5.08,26.04 70.48,33.02 10.16,17.14 64.14,31.11 62.23,26.04 19.68,20.95 53.34,26.04 56.52,26.04 59.69,18.41 49.85,16.83 53.98,15.24 57.15,15.88 30.48,9.53 34.29,9.53 60.33,13.34 63.5,8.89 71.12,8.26 75.56,5.71 31.11,26.04 15.24,21.59 27.3,13.97 76.83,18.41 26.67,9.53 73.66,17.14 70.48,17.14 12.7,19.68 5.71,75.56 55.88,8.26 41.27,3.17 58.42,3.81 63.5,1.91 67.94,1.91 72.39,1.91 36.83,1.91 54.61,3.17 34.29,19.05 50.8,1.91 26.67,19.68 36.83,6.99 45.72,3.81 50.16,50.8 43.81,12.7 31.75,12.7 44.45,8.89 48.26,12.06 52.7,10.16 1.27,8.89 36.2,14.61 27.3,26.67
  pour Top (isolate 0.254, rank 2): 45.09,80.64 45.09,68.58 43.18,66.67 41.91,66.67 41.91,72.39 31.11,72.39 31.11,63.5 35.56,59.05 53.98,59.05 58.42,63.5 58.42,65.41 57.78,66.04 67.94,66.04 67.94,72.39 64.14,72.39 64.14,77.47 60.96,80.64 80.64,80.64 80.64,-0.64 35.56,-0.64 35.56,8.26 -0.64,8.26 -0.64,80.64
  pour Bottom (isolate 0.254, rank 2): -0.64,80.64 80.64,80.64 80.64,-0.64 35.56,-1.27 35.56,8.26 -0.64,8.26
HDMI_A_5V  (via drill 0.38 pad 0.79)
  Top 0.254: J3.P$18 40.45,73.22 v40.01,73.66 | v57.78,50.16 55.88,50.16 55.32,50.72 K1.4 | v50.8,54.61 50.16,55.24 29.84,55.24 24.77,60.33 24.77,76.2 27.3,78.74 34.29,78.74 v36.83,76.2
  Bottom 0.254: R7.1 51.44,48.9 52.7,50.16 | 52.7,50.16 v57.78,50.16 | v50.8,54.61 50.8,52.07 52.7,50.16 | v40.01,73.66 40.01,74.93 38.73,76.2 v36.83,76.2
HDMI_B_5V  (via drill 0.38 pad 0.79)
  Top 0.254: K1.5 52.78,50.72 54.61,48.9 58.42,48.9 v59.69,50.16 | v66.04,62.23 66.15,62.34 J5.P$18
  Bottom 0.254: v59.69,50.16 59.05,50.8 59.05,52.7 | 59.05,52.7 59.05,55.24 v66.04,62.23 | R8.1 54.83,52.7 59.05,52.7
LED  (via drill 0.38 pad 0.79)
  Top 0.254: U1.13 45.32,30.25 46.35,29.21 48.26,29.21 51.44,32.38 54.61,32.38 55.24,31.75 v59.69,31.75 | v66.04,14.92 66.04,25.4 64.77,26.67 64.77,27.94 v66.04,29.21
  Bottom 0.254: J4.2 67.31,11.43 66.04,12.7 v66.04,14.92 | v66.04,29.21 66.04,31.75 65.41,32.38 61.59,32.38 60.96,31.75 v59.69,31.75
LVLSHF_OC_OE  (via drill 0.38 pad 0.79)
  Top 0.254: R11.1 24.55,34.87 U2.10 22.23,35.7 v22.23,34.92 | J6.3 v71.75,43.18 | v60.96,38.1 59.69,36.83 50.16,36.83 48.9,35.56 43.81,35.56 43.18,34.92 33.66,34.92 v32.38,36.2
  Bottom 0.254: v71.75,43.18 69.85,43.18 66.04,39.37 62.23,39.37 v60.96,38.1 | v32.38,36.2 32.38,35.56 29.21,32.38 26.67,32.38 26.04,31.75 22.23,31.75 21.59,32.38 21.59,34.29 v22.23,34.92
N$1  (via drill 0.38 pad 0.79)
  Top 0.254: Q2.1 4.13,70.8 v5.08,69.85
  Bottom 0.254: v5.08,69.85 R12.2
N$2
  Top 0.254: Y2.4 64.14,17.27 64.14,14.61 65.41,13.34 U4.1
N$3
  Top 0.254: Y2.1 62.66,13.54 64.14,12.06 U4.2
N$4
  Top 0.254: U1.8 51.39,30.84 Y1.3
N$5
  Top 0.254: SP1.P$2 9.21,71.12 R13.1 7.93,71.44 7.3,72.07 7.3,73.03 6.67,73.66 5.25,73.66 Q2.3
N$6
  Top 0.254: U4.7 74.08,12.06 R14.1
N$7
  Top 0.254: U2.12 33.7,37.11 R10.1
N$8  (via drill 0.38 pad 0.79)
  Top 0.254: U2.20 31.5,42.3 35.56,46.35 40.01,46.35 v41.27,45.09 | v46.35,32.38 46.12,32.15 U1.12
  Bottom 0.254: v41.27,45.09 41.27,41.91 46.35,36.83 46.35,36.2 49.53,33.02 49.53,32.38 48.9,31.75 46.99,31.75 v46.35,32.38
N$9  (via drill 0.38 pad 0.79)
  Top 0.254: U4.3 62.87,10.79 v62.23,10.16
  Bottom 0.254: v62.23,10.16 BT1.V+
N$10  (via drill 0.38 pad 0.79)
  Top 0.254: v20.32,13.97 20.89,13.4 MDL1.3
  Bottom 0.254: R5.1 19.27,13.97 v20.32,13.97
N$11
  Top 0.254: U1.7 52.53,28.67 Y1.1
N$13  (via drill 0.38 pad 0.79)
  Top 0.254: v3.81,19.05 4.16,19.4 MDL1.11
  Bottom 0.254: R4.1 4.23,19.47 v3.81,19.05
N$14  (via drill 0.38 pad 0.79)
  Top 0.254: v43.18,26.67 42.78,27.07 U1.20
  Bottom 0.254: C4.1 43.18,24.98 v43.18,26.67
N$15  (via drill 0.38 pad 0.79)
  Top 0.254: v61.59,50.8 62.94,49.45 K1.12
  Bottom 0.254: v61.59,50.8 63.3,49.1 D2.A 63.5,45.72 62.55,44.77 60.01,44.77 59.05,45.72 59.05,46.82 Q1.3
N$16
  Top 0.254: R3.2 6.63,21.38 MDL1.10
N$17  (via drill 0.38 pad 0.79)
  Top 0.254: U2.18 32.74,40.99 35.56,43.81 36.83,43.81 v37.47,44.45 | U1.17 41.02,29.47 40.64,29.84 v40.64,30.48 | v58.42,39.37 57.78,38.73 48.26,38.73 46.35,40.64 46.35,41.91 43.81,44.45 43.81,46.35 41.91,48.26 39.37,48.26 v38.73,48.9
  Bottom 0.254: v40.64,30.48 36.2,30.48 35.56,31.11 35.56,42.55 v37.47,44.45 38.73,45.72 v38.73,48.9 | J1.3 73.66,50.8 64.14,41.27 60.33,41.27 v58.42,39.37
N$18  (via drill 0.38 pad 0.79)
  Top 0.254: U2.16 33.98,39.7 36.83,42.55 38.1,42.55 40.01,40.64 v40.01,37.47 | v60.96,39.37 59.05,37.47 49.53,37.47 48.26,36.2 41.91,36.2 v41.59,35.88 | U1.16 42.39,30.96 v41.91,30.48
  Bottom 0.254: v41.91,30.48 42.55,31.11 42.55,34.92 v41.59,35.88 v40.01,37.47 | J1.1 73.66,48.26 65.41,40.01 61.59,40.01 v60.96,39.37
N$19  (via drill 0.38 pad 0.79)
  Top 0.254: U2.17 33.36,40.34 36.2,43.18 38.73,43.18 40.96,40.96 40.96,36.83 | U1.15 43.72,31.84 43.18,32.38 41.91,32.38 v41.27,31.75 | v38.73,36.2 40.32,36.2 40.96,36.83 | v59.69,39.37 58.42,38.1 48.9,38.1 47.62,36.83 40.96,36.83
  Bottom 0.254: v41.27,31.75 41.27,33.66 v38.73,36.2 | J1.4 76.2,49.53 73.66,49.53 64.77,40.64 60.96,40.64 v59.69,39.37
N$20
  Bottom 0.254: Q1.1 56.51,47.94 R9.2
N$21  (via drill 0.38 pad 0.79)
  Top 0.254: U2.14 35.23,38.41 36.83,40.01 v38.73,40.01 | v38.1,31.75 38.1,31.11 37.47,30.48 37.47,25.4 36.83,24.77 v36.2,24.77 | v47.62,20.32 46.92,21.02 U1.30
  Bottom 0.254: v38.73,40.01 38.1,40.01 37.47,39.37 37.47,33.02 38.1,32.38 v38.1,31.75 | v36.2,24.77 36.83,24.77 37.47,24.13 37.47,22.23 38.73,20.95 46.99,20.95 v47.62,20.32
N$22  (via drill 0.38 pad 0.79)
  Top 0.254: U1.31 47.72,21.5 v48.9,20.32 | v36.2,26.04 36.2,31.11 v36.83,31.75 | v37.47,41.27 36.83,41.27 34.6,39.05 U2.15
  Bottom 0.254: v48.9,20.32 47.62,21.59 39.37,21.59 38.1,22.86 38.1,25.4 37.47,26.04 v36.2,26.04 | v36.83,31.75 36.83,40.64 v37.47,41.27
N$30
  Top 0.254: J3.P$13 37.95,71.91 36.83,73.03 28.57,73.03 27.3,71.75 27.3,62.87 32.38,57.78 62.23,57.78 63.5,59.05 63.5,65.41 63.65,65.56 J5.P$13
N$31
  Top 0.254: J3.P$15 38.95,72.17 37.47,73.66 27.94,73.66 26.67,72.39 26.67,62.23 31.75,57.15 62.87,57.15 64.14,58.42 64.14,64.77 64.65,65.28 J5.P$15
N$32
  Top 0.254: J3.P$16 39.45,72.31 37.47,74.3 27.3,74.3 26.04,73.03 26.04,61.59 31.11,56.52 63.5,56.52 64.77,57.78 64.77,64.14 65.15,64.52 J5.P$16
N$33
  Top 0.254: J3.P$19 40.95,74.62 40.01,75.56 38.1,75.56 37.47,74.93 26.67,74.93 25.4,73.66 25.4,60.96 30.48,55.88 66.04,55.88 67.31,57.15 67.31,64.14 66.65,64.8 J5.P$19
N$34  (via drill 0.38 pad 0.79)
  Top 0.254: v46.99,53.34 46.35,53.98 31.11,53.98 v30.48,53.34 | v30.48,49.53 31.11,48.9 v31.11,44.45 | v25.4,33.02 v25.4,27.94 | v26.67,24.13 29.84,24.13 v30.48,23.5 | v26.67,41.91 26.67,40.01 27.3,39.37 27.3,36.2 27.94,35.56 v28.57,35.56 | v35.56,21.59 42.13,21.59 U1.25
  Bottom 0.254: R7.2 48.68,49.74 47.62,50.8 47.62,52.7 v46.99,53.34 | v30.48,53.34 v30.48,49.53 | v31.11,44.45 28.57,41.91 v26.67,41.91 | v25.4,33.02 28.57,33.02 29.21,33.66 29.21,34.92 v28.57,35.56 | v25.4,27.94 25.4,25.4 v26.67,24.13 | v30.48,23.5 32.38,21.59 v35.56,21.59
N$37  (via drill 0.38 pad 0.79)
  Top 0.254: U1.26 43.72,21.5 43.18,20.95 39.37,20.95 38.73,20.32 v36.2,20.32 | v29.21,53.98 29.84,54.61 47.62,54.61 v48.26,53.98 | v29.21,49.53 29.84,48.9 v29.84,45.09 | v26.04,43.18 25.4,42.55 25.4,40.01 26.67,38.73 26.67,35.56 v27.94,34.29 | v26.04,22.86 29.21,22.86 v29.84,22.23 | v24.13,33.02 v24.13,28.57
  Bottom 0.254: v29.21,53.98 29.21,53.34 29.84,52.7 29.84,50.16 v29.21,49.53 | v29.84,45.09 27.94,43.18 v26.04,43.18 | v27.94,34.29 25.4,34.29 v24.13,33.02 | v26.04,22.86 24.13,24.77 v24.13,28.57 | v29.84,22.23 31.75,20.32 v36.2,20.32 | v48.26,53.98 48.26,54.61 50.16,56.52 53.34,56.52 54.61,55.24 R8.2
N$41  (via drill 0.38 pad 0.79)
  Top 0.254: U2.13 35.85,37.76 36.83,38.73 v38.73,38.73 | U1.10 47.72,31.53 47.94,31.75 47.94,32.7 v48.26,33.02
  Bottom 0.254: v38.73,38.73 40.01,40.01 42.23,40.01 45.72,36.51 45.72,35.56 v48.26,33.02
PB2  (via drill 0.38 pad 0.79)
  Top 0.254: U1.14 44.52,29.91 44.13,29.53 44.13,26.99 v44.45,26.67 | v46.35,26.67 46.35,26.04 51.12,21.27 v59.05,21.27 | v74.3,19.68 72.71,21.27 v67.31,21.27
  Bottom 0.254: v44.45,26.67 v46.35,26.67 | J7.6 76.2,26.67 73.66,26.67 73.03,26.04 73.03,20.95 v74.3,19.68 | v67.31,21.27 v59.05,21.27
PD2  (via drill 0.38 pad 0.79)
  Top 0.254: v73.03,19.68 72.39,20.32 v67.31,20.32 | v59.05,20.32 57.78,20.32 57.47,20.64 49.85,20.64 48.52,21.96 U1.32
  Bottom 0.254: J7.5 73.03,27.94 72.39,27.3 72.39,20.32 v73.03,19.68 | v67.31,20.32 v59.05,20.32
PD3  (via drill 0.38 pad 0.79)
  Top 0.254: J7.1 68.9,22.86 v67.31,24.45 | U1.1 58.48,23.87 v59.05,24.45
  Bottom 0.254: v67.31,24.45 v59.05,24.45
PD4  (via drill 0.38 pad 0.79)
  Top 0.254: v71.12,27.94 66.67,27.94 v66.04,27.3 | v59.05,27.3 58.42,27.3 57.78,26.67 57.78,25.4 57.05,24.67 U1.2
  Bottom 0.254: J7.12 76.2,34.29 76.2,29.84 75.56,29.21 72.39,29.21 v71.12,27.94 | v66.04,27.3 v59.05,27.3
PD5  (via drill 0.38 pad 0.79)
  Top 0.254: U1.9 48.74,30.96 50.8,33.02 v60.33,33.02 | J7.4 76.2,24.13 69.22,24.13 67.31,26.04 v67.31,26.67
  Bottom 0.254: v67.31,26.67 67.31,31.75 66.04,33.02 v60.33,33.02
RELE  (via drill 0.38 pad 0.79)
  Top 0.254: v46.35,52.07 45.09,53.34 32.38,53.34 v31.75,52.7 | v31.75,49.53 33.02,48.26 36.83,48.26 v37.47,48.9 | v34.92,29.84 34.92,23.5 36.2,22.23 38.73,22.23 40.38,23.87 U1.24
  Bottom 0.254: R9.1 47.62,47.62 46.99,48.26 46.99,51.44 v46.35,52.07 | v31.75,52.7 v31.75,49.53 | v37.47,48.9 37.47,45.72 34.92,43.18 v34.92,29.84
RFID_MISO_3V3
  Top 0.254: U2.5 14.91,39.7 13.97,40.64 A1.MISO
RFID_MOSI_3V3  (via drill 0.38 pad 0.79)
  Top 0.254: U2.4 16.17,40.34 v15.88,40.64
  Bottom 0.254: v15.88,40.64 15.88,39.37 14.61,38.1 A1.MOSI
RFID_OC_NRST  (via drill 0.38 pad 0.79)
  Top 0.254: v34.29,46.35 34.92,46.99 40.64,46.99 42.55,45.09 42.55,43.18 43.81,41.91 43.81,40.64 v44.45,40.01 | U1.11 46.92,31.68 47.31,32.07 47.31,33.02 46.67,33.66 45.72,33.66 v45.09,33.02 | v18.41,50.16 v25.4,50.16
  Bottom 0.254: A1.RST 16.51,48.26 v18.41,50.16 | v25.4,50.16 28.57,46.99 33.66,46.99 v34.29,46.35 | v44.45,40.01 46.99,37.47 46.99,36.83 50.16,33.66 50.16,31.75 49.53,31.11 45.72,31.11 45.09,31.75 v45.09,33.02
RFID_SCK_3V3  (via drill 0.38 pad 0.79)
  Top 0.254: U2.3 17.43,40.99 v17.14,41.27
  Bottom 0.254: v17.14,41.27 17.14,36.83 15.88,35.56 A1.SCK
RFID_SS_3V3  (via drill 0.38 pad 0.79)
  Top 0.254: U2.1 18.66,42.3 v18.41,42.55
  Bottom 0.254: v18.41,42.55 18.41,40.64 17.78,40.01 17.78,34.29 16.51,33.02 A1.SDA
RST_ATM  (via drill 0.38 pad 0.79)
  Top 0.254: R1.1 46.45,18.63 C5.1 | R1.1 46.12,18.96 U1.29 46.12,23.73 45.4,24.45 45.4,28.89 v45.09,29.21 | v38.73,37.47 38.1,37.47 36.83,36.2 R10.2 | D1.A 44.34,18.73 R1.1 | v58.42,40.64 57.15,39.37 49.53,39.37 v48.9,40.01
  Bottom 0.254: v38.73,37.47 40.64,39.37 41.91,39.37 44.45,36.83 44.45,34.29 43.81,33.66 43.81,30.48 v45.09,29.21 45.72,29.84 49.53,29.84 52.7,33.02 52.7,34.92 48.9,38.73 v48.9,40.01 | J1.5 63.5,41.91 59.69,41.91 v58.42,40.64
RST_ATM_3V3  (via drill 0.38 pad 0.79)
  Top 0.254: MDL1.13 3.65,15.4 2.54,16.51 2.54,26.67 3.81,27.94 v5.71,27.94 | v8.26,28.57 17.14,28.57 19.68,31.11 19.68,35.56 21.22,37.09 U2.9
  Bottom 0.254: v5.71,27.94 7.62,27.94 v8.26,28.57
SCL  (via drill 0.38 pad 0.79)
  Top 0.254: R16.1 75.35,8.47 | U1.28 45.32,20.55 44.45,19.68 42.55,19.68 41.91,19.05 v41.91,13.34 | v45.72,6.99 v54.61,6.99 | v60.96,6.99 75.56,6.99 | 75.56,6.99 78.11,6.99 78.74,7.62 78.74,31.75 J7.10 | U4.6 72.81,10.79 R16.1 | R16.1 75.56,8.04 75.56,6.99
  Bottom 0.254: v41.91,13.34 41.91,8.26 43.18,6.99 v45.72,6.99 | v54.61,6.99 v60.96,6.99
SDA  (via drill 0.38 pad 0.79)
  Top 0.254: U4.5 72.39,9.53 v73.66,8.26 | U1.27 44.52,21.02 43.81,20.32 41.91,20.32 41.27,19.68 41.27,14.61 40.64,13.97 v40.64,13.34 | v45.72,5.71 v54.61,5.71
  Bottom 0.254: v40.64,13.34 40.64,7.62 42.55,5.71 v45.72,5.71 | v54.61,5.71 60.33,5.71 60.96,5.08 60.96,3.81 61.59,3.17 73.03,3.17 73.66,3.81 v73.66,8.26 73.66,11.64 R17.1 75.56,13.12 75.56,12.7 76.2,12.06 78.11,12.06 78.74,12.7 78.74,29.21 J7.8
TX0_N
  Top 0.3: J3.P$9 35.95,66.95 35.8,66.8 35.8,65.89 37.69,63.99 45.88,63.99 48.53,66.65 48.53,67.06 arc-90 49.38,67.91 49.41,67.91 arc90 49.78,68.29 49.78,68.77 arc90 49.41,69.14 49.38,69.14 arc-90 48.53,69.99 48.53,70.48 arc-90 49.38,71.33 49.41,71.33 arc90 49.78,71.7 49.78,72.18 arc90 49.41,72.56 49.38,72.56 arc-90 48.53,73.41 48.53,73.66 arc-90 49.78,74.92 50.84,74.92 arc90 51.21,75.29 51.21,76.47 arc-90 52.06,77.32 52.37,77.32 arc-90 53.22,76.47 53.22,75.29 arc90 53.59,74.92 59.53,74.92 61.45,73 61.45,71.88 61.65,71.69 J5.P$9
TX0_P
  Top 0.3: J3.P$7 34.95,67.17 35.32,66.8 35.32,65.69 37.49,63.52 46.07,63.52 49.01,66.45 49.01,67.06 arc-90 49.38,67.44 49.41,67.44 arc90 50.26,68.29 50.26,68.77 arc90 49.41,69.62 arc-90 49.04,69.99 49.04,70.48 arc-90 49.41,70.85 arc90 50.26,71.7 50.26,72.18 arc90 49.41,73.03 49.38,73.03 arc-90 49.01,73.41 49.01,73.66 arc-90 49.78,74.44 50.84,74.44 arc90 51.69,75.29 51.69,76.47 arc-90 52.06,76.84 52.37,76.84 arc-90 52.74,76.47 52.74,75.29 arc90 53.59,74.44 59.34,74.44 60.98,72.8 60.98,71.88 60.65,71.56 J5.P$7
TX1_N
  Top 0.3: J3.P$6 34.45,66.98 34.27,66.8 34.27,65.12 36.93,62.47 47.65,62.47 51.07,65.89 51.07,66.3 arc-90 51.92,67.15 52.86,67.15 arc90 53.23,67.52 53.23,67.75 arc90 52.86,68.12 51.92,68.12 arc-90 51.07,68.97 51.07,69.21 arc-90 51.92,70.06 52.86,70.06 arc90 53.23,70.43 53.23,70.66 arc90 52.86,71.03 51.92,71.03 arc-90 51.07,71.88 51.07,72.49 arc-90 52.23,73.64 58.77,73.64 59.93,72.49 59.93,71.88 60.15,71.66 J5.P$6
TX1_P
  Top 0.3: J3.P$4 33.45,67.15 33.8,66.8 33.8,64.92 36.73,61.99 47.85,61.99 51.55,65.69 51.55,66.3 arc-90 51.92,66.67 52.86,66.67 arc90 53.71,67.52 53.71,67.75 arc90 52.86,68.6 51.95,68.6 arc-90 51.58,68.97 51.58,69.21 arc-90 51.95,69.58 52.86,69.58 arc90 53.71,70.43 53.71,70.66 arc90 52.86,71.51 51.92,71.51 arc-90 51.55,71.88 51.55,72.29 arc-90 52.42,73.17 58.58,73.17 59.45,72.29 59.45,71.88 59.15,71.58 J5.P$4
TX2_N
  Top 0.3: J3.P$3 32.95,67 32.75,66.8 32.75,64.36 36.17,60.95 49.43,60.95 50.42,61.93 arc-90 51.62,61.93 52.59,60.96 arc90 53.12,60.96 53.69,61.53 arc90 53.69,62.06 52.72,63.03 arc-90 52.72,64.23 53.29,64.8 arc-90 54.49,64.8 55.27,64.02 arc90 55.8,64.02 56.36,64.59 arc90 56.36,65.11 55.58,65.9 arc-90 55.58,67.1 56.15,67.66 56.15,71.73 56.81,72.39 58.17,72.39 58.65,71.91 J5.P$3
TX2_P
  Top 0.3: J3.P$1 31.95,67.12 32.27,66.8 32.27,64.16 35.97,60.47 49.63,60.47 50.76,61.59 arc-90 51.28,61.59 52.25,60.63 arc90 53.45,60.63 54.02,61.2 arc90 54.02,62.4 53.05,63.37 arc-90 53.05,63.89 53.62,64.46 arc-90 54.15,64.46 55.12,63.49 arc90 56.32,63.49 56.89,64.06 arc90 56.89,65.27 55.92,66.23 arc-90 55.92,66.76 56.63,67.47 56.63,71.53 56.98,71.88 57.4,71.88 57.66,71.63 57.65,71.62 J5.P$1

### Text on the board
bPlace: Hoky V2r1 / 01-07-16 | Antena
Measures: (Distancia que sobresalen / los bordes de los conectores / desde el borde de la PCB, / es la misma para todos) | USB | HDMI1 | HDMI2 | Gravedad / caja horizontal | Gravedad caja vertical | 1/8'' o M3
Document: SET POLYGON_RATSNEST ON / OFF; / Ancho pista min: 10mil / Via drill: 15mil / Via diam: 31mil